# Altium schematic sheet DDR3.SchDoc
size A4; SheetNumber: 2; SheetTotal: 7
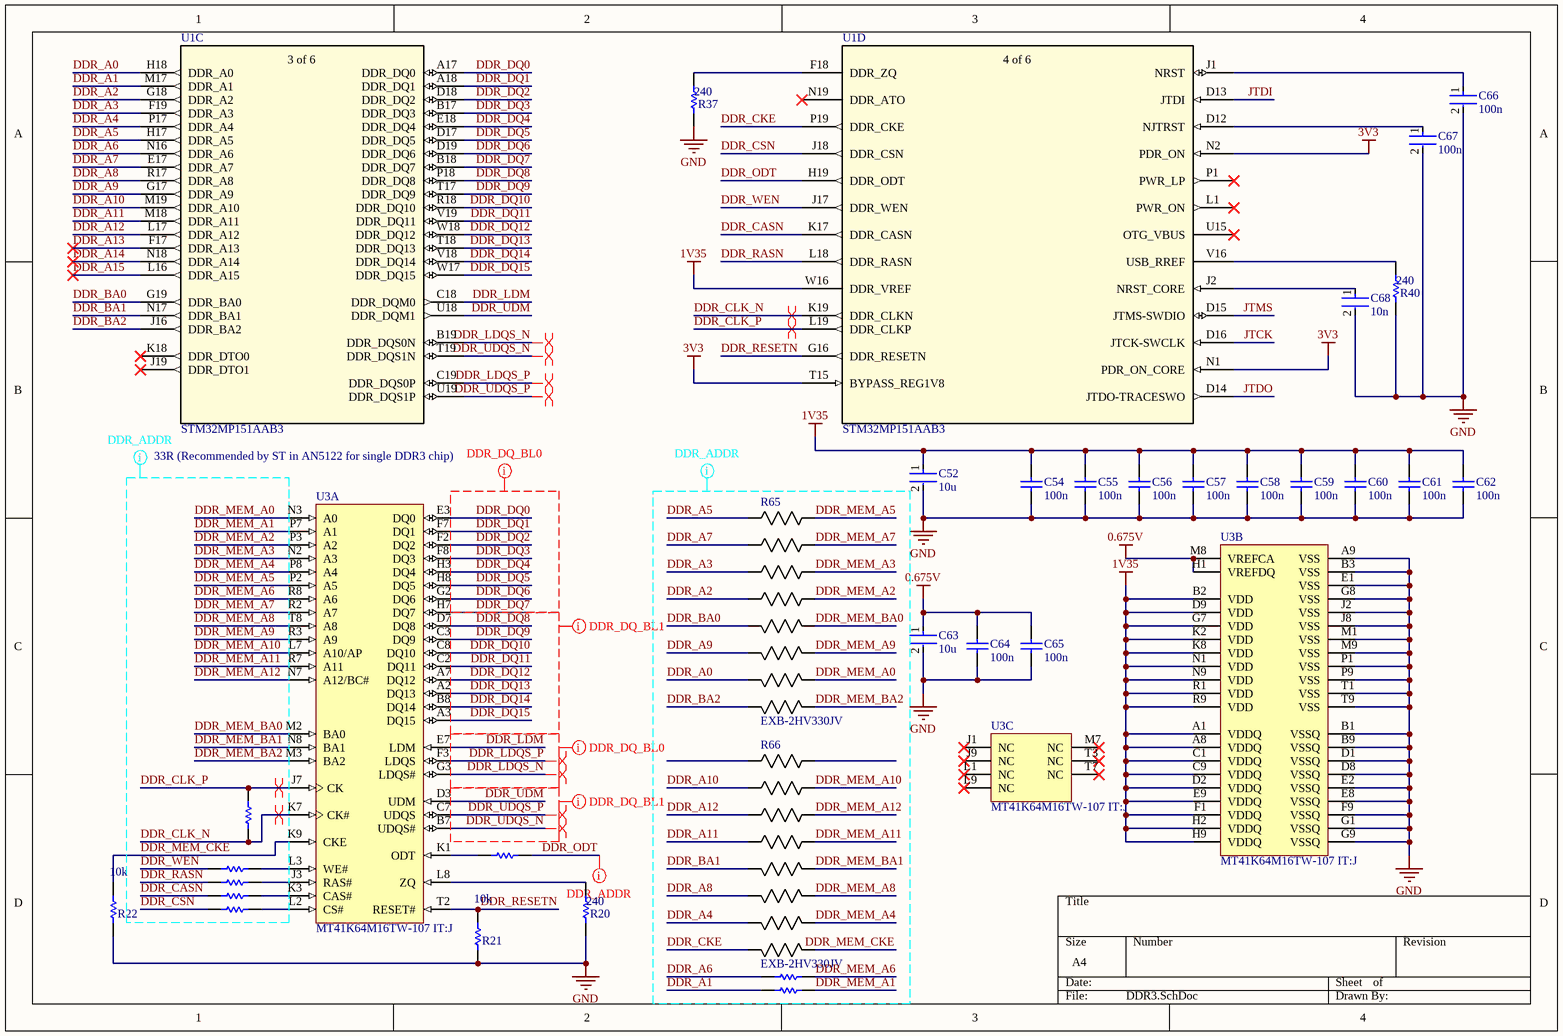
[diagram p0: DDR3.SchDoc]

## Parts
C52  10u  [FP-CC0805-0_85-MFG]
C54  100n  [CAPC0603X33X15LL03T05]
C55  100n  [CAPC0603X33X15LL03T05]
C56  100n  [CAPC0603X33X15LL03T05]
C57  100n  [CAPC0603X33X15LL03T05]
C58  100n  [CAPC0603X33X15LL03T05]
C59  100n  [CAPC0603X33X15LL03T05]
C60  100n  [CAPC0603X33X15LL03T05]
C61  100n  [CAPC0603X33X15LL03T05]
C62  100n  [CAPC0603X33X15LL03T05]
C63  10u  [FP-CC0805-0_85-MFG]
C64  100n  [CAPC0603X33X15LL03T05]
C65  100n  [CAPC0603X33X15LL03T05]
C66  100n  [FP-C0603C-CF-MFG]
C67  100n  [FP-C0603C-CF-MFG]
C68  10n  [FP-C0603C-CF-MFG]
R13  CRCW0201100RFKED  [RESC0603X28X15ML05T05]  (value not drawn)
R14  CRCW0201100RFKED  [RESC0603X28X15ML05T05]  (value not drawn)
R15  CRCW0201100RFKED  [RESC0603X28X15ML05T05]  (value not drawn)
R16  CRCW0201100RFKED  [RESC0603X28X15ML05T05]  (value not drawn)
R17  CRCW0201100RFKED  [RESC0603X28X15ML05T05]  (value not drawn)
R18  CRCW0201100RFKED  [RESC0603X28X15ML05T05]  (value not drawn)
R19  CRCW0201100RFKED  [RESC0603X28X15ML05T05]  (value not drawn)
R20  240  [RESC1609X50X30NL8T20]
R21  10k  [RESC0603X28X15ML05T05]
R22  10k  [RESC0603X28X15ML05T05]
R29  CRCW0201100RFKED  [RESC0603X28X15ML05T05]  (value not drawn)
R37  240  [RESC1609X50X30NL8T20]
R40  240  [RESC1609X50X30NL8T20]
R65  EXB-2HV330JV  [RES_EXB2HV]
R66  EXB-2HV330JV  [RES_EXB2HV]
U1  STM32MP151AAB3  [LFBGA354_16X16_STM]  (parts C,D of 6)
U3  MT41K64M16TW-107 IT:J  [MICT-TW-96]  (parts A,B,C of 3)

## Nets
0.675V: C63.1 C64.2 C65.2 U3.H1(VREFDQ) U3.M8(VREFCA)
1V35: C52.1 C54.2 C55.2 C56.2 C57.2 C58.2 C59.2 C60.2 C61.2 C62.2 U1.W16(DDR_VREF) U3.A1(VDDQ) U3.A8(VDDQ) U3.B2(VDD) U3.C1(VDDQ) U3.C9(VDDQ) U3.D2(VDDQ) U3.D9(VDD) U3.E9(VDDQ) U3.F1(VDDQ) U3.G7(VDD) U3.H2(VDDQ) U3.H9(VDDQ) U3.K2(VDD) U3.K8(VDD) U3.N1(VDD) U3.N9(VDD) U3.R1(VDD) U3.R9(VDD)
3V3: U1.N1(PDR_ON_CORE) U1.N2(PDR_ON) U1.T15(BYPASS_REG1V8)
GND: C52.2 C54.1 C55.1 C56.1 C57.1 C58.1 C59.1 C60.1 C61.1 C62.1 C63.2 C64.1 C65.1 C66.2 C67.2 C68.2 R20.1 R21.1 R22.1 R37.1 R40.1 U3.A9(VSS) U3.B1(VSSQ) U3.B3(VSS) U3.B9(VSSQ) U3.D1(VSSQ) U3.D8(VSSQ) U3.E1(VSS) U3.E2(VSSQ) U3.E8(VSSQ) U3.F9(VSSQ) U3.G1(VSSQ) U3.G8(VSS) U3.G9(VSSQ) U3.J2(VSS) U3.J8(VSS) U3.M1(VSS) U3.M9(VSS) U3.P1(VSS) U3.P9(VSS) U3.T1(VSS) U3.T9(VSS)
DDR_A0: R65.7 U1.H18(DDR_A0)
DDR_A1: R19.1 U1.M17(DDR_A1)
DDR_A2: R65.4 U1.G18(DDR_A2)
DDR_A3: R65.3 U1.F19(DDR_A3)
DDR_A4: R66.7 U1.P17(DDR_A4)
DDR_A5: R65.1 U1.H17(DDR_A5)
DDR_A6: R18.1 U1.N16(DDR_A6)
DDR_A7: R65.2 U1.E17(DDR_A7)
DDR_A8: R66.6 U1.R17(DDR_A8)
DDR_A9: R65.6 U1.G17(DDR_A9)
DDR_A10: R66.2 U1.M19(DDR_A10)
DDR_A11: R66.4 U1.M18(DDR_A11)
DDR_A12: R66.3 U1.L17(DDR_A12)
DDR_A13: U1.F17(DDR_A13)
DDR_A14: U1.N18(DDR_A14)
DDR_A15: U1.L16(DDR_A15)
DDR_BA0: R65.5 U1.G19(DDR_BA0)
DDR_BA1: R66.5 U1.N17(DDR_BA1)
DDR_BA2: R65.8 U1.J16(DDR_BA2)
DDR_CASN: R16.1 U1.K17(DDR_CASN)
DDR_CKE: R66.8 U1.P19(DDR_CKE)
DDR_CLK_N: R29.1 U1.K19(DDR_CLKN) U3.K7(CK#)
DDR_CLK_P: R29.2 U1.L19(DDR_CLKP) U3.J7(CK)
DDR_CSN: R17.1 U1.J18(DDR_CSN)
DDR_DQ0: U1.A17(DDR_DQ0) U3.E3(DQ0)
DDR_DQ1: U1.A18(DDR_DQ1) U3.F7(DQ1)
DDR_DQ2: U1.D18(DDR_DQ2) U3.F2(DQ2)
DDR_DQ3: U1.B17(DDR_DQ3) U3.F8(DQ3)
DDR_DQ4: U1.E18(DDR_DQ4) U3.H3(DQ4)
DDR_DQ5: U1.D17(DDR_DQ5) U3.H8(DQ5)
DDR_DQ6: U1.D19(DDR_DQ6) U3.G2(DQ6)
DDR_DQ7: U1.B18(DDR_DQ7) U3.H7(DQ7)
DDR_DQ8: U1.P18(DDR_DQ8) U3.D7(DQ8)
DDR_DQ9: U1.T17(DDR_DQ9) U3.C3(DQ9)
DDR_DQ10: U1.R18(DDR_DQ10) U3.C8(DQ10)
DDR_DQ11: U1.V19(DDR_DQ11) U3.C2(DQ11)
DDR_DQ12: U1.W18(DDR_DQ12) U3.A7(DQ12)
DDR_DQ13: U1.T18(DDR_DQ13) U3.A2(DQ13)
DDR_DQ14: U1.V18(DDR_DQ14) U3.B8(DQ14)
DDR_DQ15: U1.W17(DDR_DQ15) U3.A3(DQ15)
DDR_LDM: U1.C18(DDR_DQM0) U3.E7(LDM)
DDR_LDQS_N: U1.B19(DDR_DQS0N) U3.G3(LDQS#)
DDR_LDQS_P: U1.C19(DDR_DQS0P) U3.F3(LDQS)
DDR_MEM_A0: R65.10 U3.N3(A0)
DDR_MEM_A1: R19.2 U3.P7(A1)
DDR_MEM_A2: R65.13 U3.P3(A2)
DDR_MEM_A3: R65.14 U3.N2(A3)
DDR_MEM_A4: R66.10 U3.P8(A4)
DDR_MEM_A5: R65.16 U3.P2(A5)
DDR_MEM_A6: R18.2 U3.R8(A6)
DDR_MEM_A7: R65.15 U3.R2(A7)
DDR_MEM_A8: R66.11 U3.T8(A8)
DDR_MEM_A9: R65.11 U3.R3(A9)
DDR_MEM_A10: R66.15 U3.L7(A10/AP)
DDR_MEM_A11: R66.13 U3.R7(A11)
DDR_MEM_A12: R66.14 U3.N7(A12/BC#)
DDR_MEM_BA0: R65.12 U3.M2(BA0)
DDR_MEM_BA1: R66.12 U3.N8(BA1)
DDR_MEM_BA2: R65.9 U3.M3(BA2)
DDR_MEM_CKE: R22.2 R66.9 U3.K9(CKE)
DDR_ODT: R13.2 U1.H19(DDR_ODT)
DDR_RASN: R15.1 U1.L18(DDR_RASN)
DDR_RESETN: R21.2 U1.G16(DDR_RESETN) U3.T2(RESET#)
DDR_UDM: U1.U18(DDR_DQM1) U3.D3(UDM)
DDR_UDQS_N: U1.T19(DDR_DQS1N) U3.B7(UDQS#)
DDR_UDQS_P: U1.U19(DDR_DQS1P) U3.C7(UDQS)
DDR_WEN: R14.1 U1.J17(DDR_WEN)
JTCK: U1.D16(JTCK-SWCLK)
JTDI: U1.D13(JTDI)
JTDO: U1.D14(JTDO-TRACESWO)
JTMS: U1.D15(JTMS-SWDIO)
NetC66_1: C66.1 U1.J1(NRST)
NetC67_1: C67.1 U1.D12(NJTRST)
NetC68_1: C68.1 U1.J2(NRST_CORE)
NetR13_1: R13.1 U3.K1(ODT)
NetR14_2: R14.2 U3.L3(WE#)
NetR15_2: R15.2 U3.J3(RAS#)
NetR16_2: R16.2 U3.K3(CAS#)
NetR17_2: R17.2 U3.L2(CS#)
NetR20_2: R20.2 U3.L8(ZQ)
NetR37_2: R37.2 U1.F18(DDR_ZQ)
NetR40_2: R40.2 U1.V16(USB_RREF)

Not connected (* = marked no-connect by the designer): R66 1 16; U1 J19(DDR_DTO1)* K18(DDR_DTO0)* L1(PWR_ON)* N19(DDR_ATO)* P1(PWR_LP)* U15(OTG_VBUS)*; U3 J1(NC)* J9(NC)* L1(NC)* L9(NC)* M7(NC)* T3(NC)* T7(NC)*

## Layout directives
differential pair: DDR_CLK_N, DDR_CLK_P, DDR_LDQS_N, DDR_LDQS_P, DDR_UDQS_N, DDR_UDQS_P
net class DDR_ADDR: DDR_A0, DDR_A1, DDR_A2, DDR_A3, DDR_A4, DDR_A5, DDR_A6, DDR_A7, DDR_A8, DDR_A9, DDR_A10, DDR_A11, DDR_A12, DDR_BA0, DDR_BA1, DDR_BA2, DDR_CASN, DDR_CKE, DDR_CLK_N, DDR_CLK_P, DDR_CSN, DDR_MEM_A0, DDR_MEM_A1, DDR_MEM_A2, DDR_MEM_A3, DDR_MEM_A4, DDR_MEM_A5, DDR_MEM_A6, DDR_MEM_A7, DDR_MEM_A8, DDR_MEM_A9, DDR_MEM_A10, DDR_MEM_A11, DDR_MEM_A12, DDR_MEM_BA0, DDR_MEM_BA1, DDR_MEM_BA2, DDR_MEM_CKE, DDR_ODT, DDR_RASN, DDR_WEN
net class DDR_DQ_BL0: DDR_DQ0, DDR_DQ1, DDR_DQ2, DDR_DQ3, DDR_DQ4, DDR_DQ5, DDR_DQ6, DDR_DQ7, DDR_LDM, DDR_LDQS_N, DDR_LDQS_P
net class DDR_DQ_BL1: DDR_DQ7, DDR_DQ8, DDR_DQ9, DDR_DQ10, DDR_DQ11, DDR_DQ12, DDR_DQ13, DDR_DQ14, DDR_DQ15, DDR_UDM, DDR_UDQS_N, DDR_UDQS_P

## Notes on the sheet
- 33R (Recommended by ST in AN5122 for single DDR3 chip)
- (in symbol STM32MP151AAB3, part C) 3 of 6
- (in symbol STM32MP151AAB3, part D) 4 of 6

## Library data of the parts
C52 C63 = CMP-2100-03606-3: CAP CER 0.1UF 50V X7R 0805; Manufacturer Part Number: CC0805KRX7R9BB104; Manufacturer: Yageo; Tolerance: 0.1; Capacitance: 100 nF; Value: 100 nF; Material: Ceramic; Device Class L1: Passive Components; ComponentLink2Description: Datasheet; Package: CC0805-0.85; Digikey Description: CAP CER 0.1UF 50V X7R 0805; Device Class L3: Ceramic Capacitors; Temperature: -30°C to +85°C; Temperature Characteristic: X7R; Voltage Rating: 50 V; Height: 0.95mm; RoHS: TRUE; Ipc Land Pattern Name: CAPC200125X85; Device Class L2: Capacitors; Category: Cap; Temperature Range Low: -30°C; Temperature Range High: +85°C; Mouser Description: Multilayer Ceramic Capacitors MLCC - SMD/SMT 100nF 50V X7R 10%; Footprint Url: http://www.yageo.com/exep/pages/download/literatures/UPY-C_GEN_24.pdf; Automotive: No; Octopart: https://octopart.com/cc0805krx7r9bb104-yageo-192993; Lead Free: Yes; ComponentLink2URL: http://www.yageo.com/documents/recent/UPY-GPHC_Y5V_6.3V-to-50V_8.pdf
C54-C62 C64 C65 = CMP-2010-00159-1: Part Number: 02016D104KAT2A; Manufacturer: AVX Interconnect / Elco
C66-C68 = CMP-2006-03061-2: CAP CER 0.1UF 50V X7R 0603; Manufacturer: KEMET; Manufacturer Part Number: C0603C104K5RACTU; Tolerance: 0.1; Temperature Coefficient: 30ppm/°C; Material: Ceramic; Automotive Grade: Grade 1; Value: 0.10 μF; Temperature: -55°C to +125°C; RoHS: TRUE; Temperature Range High: +125°C; Lead Free: Yes; Octopart: https://octopart.com/c0603c104k5ractu-kemet-139244; Digikey Description: CAP CER 0.1UF 50V X7R 0603; Category: Cap; Package: C0603C-CF; ComponentLink2Description: Datasheet; Temperature Range Low: -55°C; Device Class L1: Passive Components; Voltage Rating: 50 V; Automotive: Yes; Device Class L3: Ceramic Capacitors; ComponentLink2URL: https://api.kemet.com/component-edge/download/datasheet/C0603C100J5GACAUTO.pdf; Capacitance: 0.10 μF; Device Class L2: Capacitors; Temperature Characteristic: X7R; Height: 0.87mm
R13-R19 R29 = CMP-2004-00005-1: Manufacturer: Vishay; Part Number: CRCW0201100RFKED
R20 R37 R40 = CMP-1666-00005-4: Chip Resistor, 10 KOhm, +/- 1%, 100 mW, -55 to 155 degC, 0603 (1608 Metric), RoHS, Tape and Reel; Manufacturer: Vishay Semiconductor; Voltage Rating: 75 V; Max Operating Temperature: 155 degC; PackageDescription: 2-Pin Surface Mount Device, Body 1.575 x 0.85 mm; ComponentLink1Description: Manufacturer URL; RoHSCompliant: true; PackageReference: 0603; REACH SVHC: Unknown; Length: 1.55 mm; DatasheetVersion: 06/2012; Packaging: Tape and Reel; Min Operating Temperature: -55 degC; Mounting Technology: Surface Mount; ComponentLink2URL: https://datasheet.ciiva.com/11809/0900766b80d98afc-11809037.pdf; Height: 0.45 mm; ComponentLink2Description: Datasheet; Package Quantity: 5000; ComponentLink1URL: http://www.vishay.com/
R21 R22 = CMP-2004-00005-1: Part Number: CRCW0201100RFKED; Manufacturer: Vishay
R65 R66 = EXB-2HV330JV: No Description Available; Mfr_Name: Panasonic
U1 = STM32MP151AAB3: No Description Available; Mfr_Name: STMicroelectronics; RefDes: RefDes; Type: Type
U3 = CMP-2000-06774-1: 1 Gb DDR3L 1866 SDRAM, 64 Mb x 16, 1.07 ns, 1.35 V, -40 to 95 degC, 96-Ball FBGA (TW), RoHS, Tray; Manufacturer: Micron; Density: 1Gb; Screening Level: Industrial; Maximum Clock Rate: 933MHz; Number of Bits per Word: 16Bit; Max Processing Temp: 260; Organization: 64Mx16; Lead Finish: Tin; Address Bus Width: 13Bit; Maximum Operating Current: 63mA; Operating Supply Voltage: 1.35V; Type: DDR3LSDRAM; Mounting Technology: SurfaceMount; Mounting: SurfaceMount; Manufacturer URL: http://www.micron.com/; Number of I/O Lines: 16Bit; Data Bus Width: 16Bit; Datasheet Version: Rev. K, 09/2014; Operating Temperature: -40to95C; Package Description: 96-Ball Fine Pitch Ball Grid Array, Body 8 x 14 mm, Pitch 0.8 mm; Datasheet URL: https://www.micron.com/~/media/documents/products/data-sheet/dram/ddr3/1gb_1_35v_ddr3l.pdf; Package Reference: TW-96